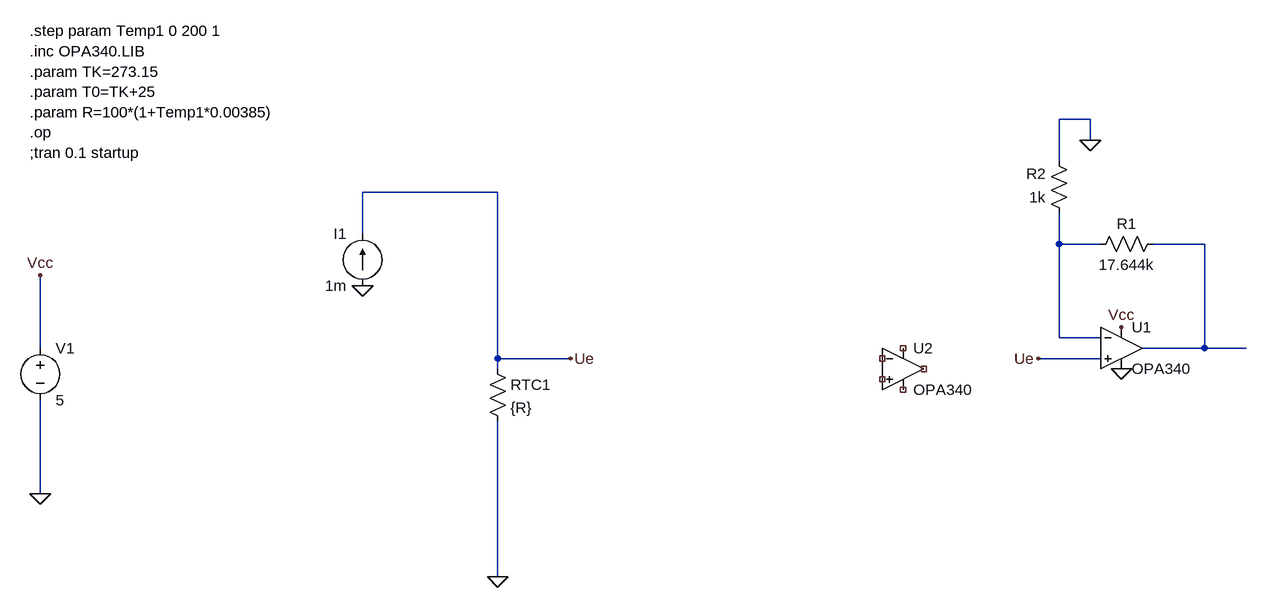
[diagram p0: schematic PT1000_Circuit_v02.asc]
PT1000_Circuit_v02.asc, the LTspice schematic file:
Version 4
SHEET 1 1396 680
WIRE 464 -288 416 -288
WIRE 464 -256 464 -288
WIRE 416 -224 416 -288
WIRE -448 -176 -656 -176
WIRE -656 -112 -656 -176
WIRE 416 -96 416 -144
WIRE 480 -96 416 -96
WIRE 640 -96 560 -96
WIRE 416 48 416 -96
WIRE 480 48 416 48
WIRE -1152 64 -1152 -48
WIRE 640 64 640 -96
WIRE 640 64 544 64
WIRE 704 64 640 64
WIRE -448 80 -448 -176
WIRE -336 80 -448 80
WIRE 480 80 384 80
WIRE -448 96 -448 80
WIRE -1152 288 -1152 144
WIRE -448 416 -448 176
FLAG -1152 288 0
FLAG -1152 -48 Vcc
FLAG -448 416 0
FLAG -656 -32 0
FLAG -336 80 Ue
FLAG 384 80 Ue
FLAG 512 96 0
FLAG 512 32 Vcc
FLAG 464 -256 0
SYMBOL voltage -1152 48 R0
WINDOW 123 0 0 Left 2
WINDOW 39 0 0 Left 2
SYMATTR InstName V1
SYMATTR Value 5
SYMBOL res -464 80 R0
SYMATTR InstName RTC1
SYMATTR Value {R}
SYMBOL current -656 -32 R180
WINDOW 0 24 80 Left 2
WINDOW 3 24 0 Left 2
WINDOW 123 0 0 Left 2
WINDOW 39 0 0 Left 2
SYMATTR InstName I1
SYMATTR Value 1m
SYMBOL Opamps\\opamp2 512 0 R0
SYMATTR InstName U1
SYMATTR Value OPA340
SYMATTR SpiceModel OPA340
SYMBOL res 576 -112 R90
WINDOW 0 0 56 VBottom 2
WINDOW 3 32 56 VTop 2
SYMATTR InstName R1
SYMATTR Value 17.644k
SYMBOL res 432 -128 R180
WINDOW 0 36 76 Left 2
WINDOW 3 36 40 Left 2
SYMATTR InstName R2
SYMATTR Value 1k
SYMBOL Opamps\\opamp2 176 32 R0
SYMATTR InstName U2
SYMATTR Value OPA340
SYMATTR SpiceModel OPA340
TEXT -1168 -424 Left 2 !.step param Temp1 0 200 1\n.inc OPA340.LIB\n.param TK=273.15\n.param T0=TK+25\n.param R=100*(1+Temp1*0.00385)\n.op\n;tran 0.1 startup

The netlist it stands for:
* PT1000_Circuit_v02.asc
V1 Vcc 0 5
RTC1 Ue 0 {R}
I1 0 Ue 1m
XU1 Ue N001 Vcc 0 N002 OPA340 OPA340  ; pins In+ In- V+ V- OUT
R1 N002 N001 17.644k
R2 N001 0 1k
XU2 NC_01 NC_02 NC_03 NC_04 NC_05 OPA340 OPA340  ; pins In+ In- V+ V- OUT
.step param Temp1 0 200 1
.inc OPA340.LIB
.param TK=273.15
.param T0=TK+25
.param R=100*(1+Temp1*0.00385)
.op
;tran 0.1 startup
.backanno
.end